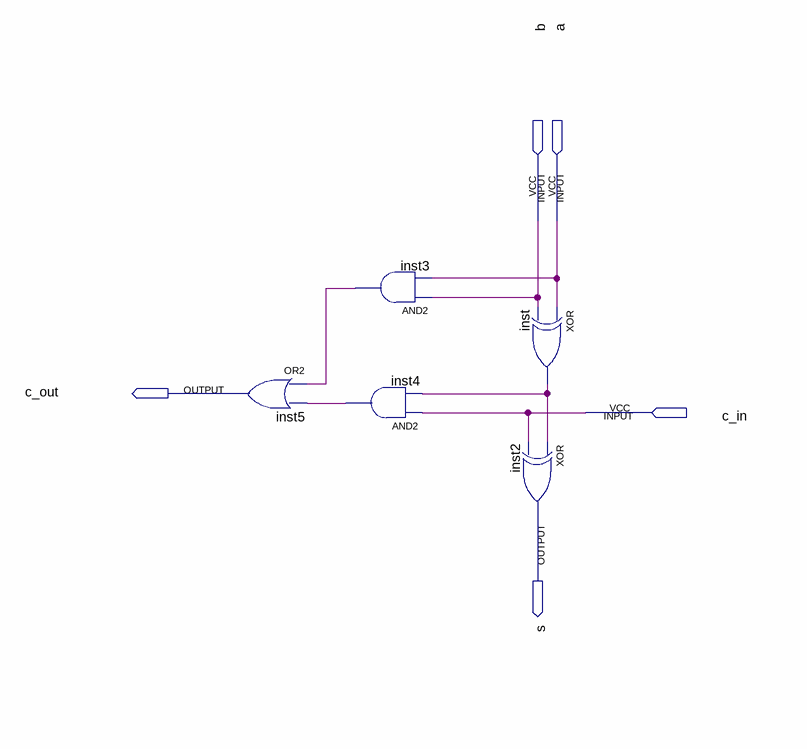
[diagram p0: schematic sheet]
// Quartus schematic full_adder.bdf as structural Verilog: 5 symbols, 5 pins
module full_adder (
  input  b,
  input  a,
  input  c_in,
  output c_out,
  output s
);

  wire inst3_out, inst4_out, inst_out;

  or inst5 (c_out, inst3_out, inst4_out);
  and inst3 (inst3_out, b, a);
  and inst4 (inst4_out, c_in, inst_out);
  xor inst (inst_out, a, b);
  xor inst2 (s, inst_out, c_in);
endmodule
